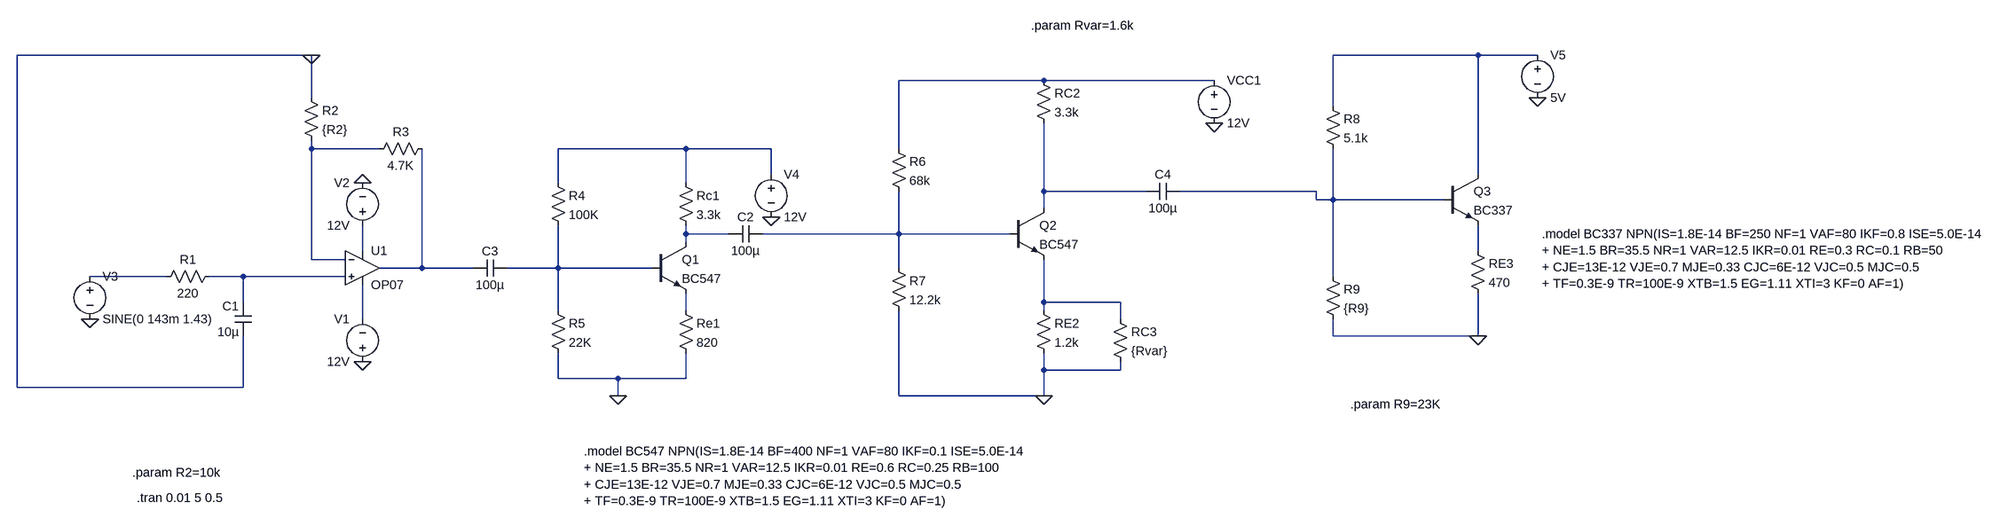
[diagram p0: schematic Project PPG-Based Heartbeat Amplifier.asc]
Project PPG-Based Heartbeat Amplifier.asc, the LTspice schematic file:
Version 4
SHEET 1 1924 680
WIRE -1408 -432 -2016 -432
WIRE 912 -432 640 -432
WIRE 1024 -432 912 -432
WIRE -32 -384 -304 -384
WIRE 288 -384 -32 -384
WIRE -1408 -352 -1408 -432
WIRE 640 -336 640 -432
WIRE -1408 -256 -1408 -272
WIRE -1280 -256 -1408 -256
WIRE -704 -256 -944 -256
WIRE -544 -256 -704 -256
WIRE -304 -256 -304 -384
WIRE -544 -208 -544 -256
WIRE 912 -208 912 -432
WIRE -944 -192 -944 -256
WIRE -704 -192 -704 -256
WIRE -32 -176 -32 -304
WIRE 160 -176 -32 -176
WIRE 608 -176 224 -176
WIRE 608 -160 608 -176
WIRE 640 -160 640 -256
WIRE 640 -160 608 -160
WIRE 848 -160 640 -160
WIRE -32 -144 -32 -176
WIRE -704 -96 -704 -112
WIRE -624 -96 -704 -96
WIRE -304 -96 -304 -176
WIRE -304 -96 -560 -96
WIRE -96 -96 -304 -96
WIRE -704 -80 -704 -96
WIRE -1312 -64 -1312 -112
WIRE 912 -64 912 -112
WIRE -1408 -48 -1408 -256
WIRE -1344 -48 -1408 -48
WIRE -1200 -32 -1200 -256
WIRE -1200 -32 -1280 -32
WIRE -1104 -32 -1200 -32
WIRE -944 -32 -944 -112
WIRE -944 -32 -1040 -32
WIRE -768 -32 -944 -32
WIRE -304 -32 -304 -96
WIRE -1680 -16 -1824 -16
WIRE -1536 -16 -1600 -16
WIRE -1344 -16 -1536 -16
WIRE 640 -16 640 -160
WIRE -1536 32 -1536 -16
WIRE -32 32 -32 -48
WIRE 112 32 -32 32
WIRE -944 48 -944 -32
WIRE -704 48 -704 16
WIRE -32 48 -32 32
WIRE -1312 64 -1312 0
WIRE 112 64 112 32
WIRE 640 96 640 64
WIRE 912 96 912 16
WIRE 912 96 640 96
WIRE -32 160 -32 128
WIRE 112 160 112 144
WIRE 112 160 -32 160
WIRE -944 176 -944 128
WIRE -832 176 -944 176
WIRE -704 176 -704 128
WIRE -704 176 -832 176
WIRE -2016 192 -2016 -432
WIRE -1536 192 -1536 96
WIRE -1536 192 -2016 192
WIRE -832 208 -832 176
WIRE -304 208 -304 48
WIRE -32 208 -32 160
WIRE -32 208 -304 208
FLAG -1408 -432 0
FLAG -1312 -192 0
FLAG -1312 144 0
FLAG -1824 64 0
FLAG -832 208 0
FLAG -544 -128 0
FLAG 288 -304 0
FLAG -32 208 0
FLAG 1024 -352 0
FLAG 912 96 0
SYMBOL Voltage -1312 160 R180
WINDOW 0 24 96 Left 2
WINDOW 3 24 16 Left 2
SYMATTR InstName V1
SYMATTR Value 12V
SYMBOL Voltage -1312 -96 R180
WINDOW 0 24 96 Left 2
WINDOW 3 24 16 Left 2
SYMATTR InstName V2
SYMATTR Value 12V
SYMBOL Voltage -1824 -32 R0
WINDOW 123 0 0 Left 0
WINDOW 39 0 0 Left 0
SYMATTR InstName V3
SYMATTR Value SINE(0 143m 1.43)
SYMBOL Res -1696 0 R270
WINDOW 0 32 56 VTop 2
WINDOW 3 0 56 VBottom 2
SYMATTR InstName R1
SYMATTR Value 220
SYMBOL Res -1424 -368 R0
SYMATTR InstName R2
SYMATTR Value {R2}
SYMBOL Res -1296 -240 R270
WINDOW 0 32 56 VTop 2
WINDOW 3 0 56 VBottom 2
SYMATTR InstName R3
SYMATTR Value 4.7K
SYMBOL Cap -1520 96 R180
WINDOW 0 24 56 Left 2
WINDOW 3 24 8 Left 2
SYMATTR InstName C1
SYMATTR Value 10µ
SYMBOL npn -768 -80 R0
SYMATTR InstName Q1
SYMATTR Value BC547
SYMBOL Res -720 32 R0
SYMATTR InstName Re1
SYMATTR Value 820
SYMBOL Res -720 -208 R0
SYMATTR InstName Rc1
SYMATTR Value 3.3k
SYMBOL Res -960 -208 R0
SYMATTR InstName R4
SYMATTR Value 100K
SYMBOL Res -960 32 R0
SYMATTR InstName R5
SYMATTR Value 22K
SYMBOL Voltage -544 -224 R0
SYMATTR InstName V4
SYMATTR Value 12V
SYMBOL Cap -624 -80 R270
WINDOW 0 32 32 VTop 2
WINDOW 3 0 32 VBottom 2
SYMATTR InstName C2
SYMATTR Value 100µ
SYMBOL Cap -1104 -16 R270
WINDOW 0 32 32 VTop 2
WINDOW 3 0 32 VBottom 2
SYMATTR InstName C3
SYMATTR Value 100µ
SYMBOL npn -96 -144 R0
SYMATTR InstName Q2
SYMATTR Value BC547
SYMBOL Res -320 -272 R0
SYMATTR InstName R6
SYMATTR Value 68k
SYMBOL Res -320 -48 R0
SYMATTR InstName R7
SYMATTR Value 12.2k
SYMBOL Res -48 -400 R0
SYMATTR InstName RC2
SYMATTR Value 3.3k
SYMBOL Res 96 48 R0
SYMATTR InstName RC3
SYMATTR Value {Rvar}
SYMBOL Res -48 32 R0
SYMATTR InstName RE2
SYMATTR Value 1.2k
SYMBOL Voltage 288 -400 R0
SYMATTR InstName VCC1
SYMATTR Value 12V
SYMBOL Cap 160 -160 R270
WINDOW 0 32 32 VTop 2
WINDOW 3 0 32 VBottom 2
SYMATTR InstName C4
SYMATTR Value 100µ
SYMBOL npn 848 -208 R0
SYMATTR InstName Q3
SYMATTR Value BC337
SYMBOL Res 896 -80 R0
SYMATTR InstName RE3
SYMATTR Value 470
SYMBOL Res 624 -352 R0
SYMATTR InstName R8
SYMATTR Value 5.1k
SYMBOL Res 624 -32 R0
SYMATTR InstName R9
SYMATTR Value {R9}
SYMBOL Voltage 1024 -448 R0
SYMATTR InstName V5
SYMATTR Value 5V
SYMBOL OpAmps\\OP07 -1312 -96 R0
SYMATTR InstName U1
TEXT -1744 352 Left 2 !.param R2=10k
TEXT -1736 400 Left 2 !.tran 0.01 5 0.5
TEXT -896 312 Left 2 !.model BC547 NPN(IS=1.8E-14 BF=400 NF=1 VAF=80 IKF=0.1 ISE=5.0E-14 \n+ NE=1.5 BR=35.5 NR=1 VAR=12.5 IKR=0.01 RE=0.6 RC=0.25 RB=100 \n+ CJE=13E-12 VJE=0.7 MJE=0.33 CJC=6E-12 VJC=0.5 MJC=0.5 \n+ TF=0.3E-9 TR=100E-9 XTB=1.5 EG=1.11 XTI=3 KF=0 AF=1)
TEXT -56 -488 Left 2 !.param Rvar=1.6k
TEXT 672 224 Left 2 !.param R9=23K
TEXT 1032 -96 Left 2 !.model BC337 NPN(IS=1.8E-14 BF=250 NF=1 VAF=80 IKF=0.8 ISE=5.0E-14\n+ NE=1.5 BR=35.5 NR=1 VAR=12.5 IKR=0.01 RE=0.3 RC=0.1 RB=50\n+ CJE=13E-12 VJE=0.7 MJE=0.33 CJC=6E-12 VJC=0.5 MJC=0.5\n+ TF=0.3E-9 TR=100E-9 XTB=1.5 EG=1.11 XTI=3 KF=0 AF=1)

The netlist it stands for:
* Project PPG-Based Heartbeat Amplifier.asc
V1 0 N017 12V
V2 N009 0 12V
V3 N013 0 SINE(0 143m 1.43)
R1 N013 N014 220
R2 0 N003 {R2}
R3 N003 N011 4.7K
C1 0 N014 10µ
Q1 N007 N012 N016 0 BC547
Re1 N016 0 820
Rc1 N004 N007 3.3k
R4 N004 N012 100K
R5 N012 0 22K
V4 N004 0 12V
C2 N007 N008 100µ
C3 N011 N012 100µ
Q2 N005 N008 N015 0 BC547
R6 N002 N008 68k
R7 N008 0 12.2k
RC2 N002 N005 3.3k
RC3 N015 0 {Rvar}
RE2 N015 0 1.2k
VCC1 N002 0 12V
C4 N005 N006 100µ
Q3 N001 N006 N010 0 BC337
RE3 N010 0 470
R8 N001 N006 5.1k
R9 N006 0 {R9}
V5 N001 0 5V
XU1 N014 N003 N009 N017 N011 LT1001  ; OP07, pins In+ In- V+ V- OUT
.model NPN NPN
.model PNP PNP
.lib standard.bjt
.param R2=10k
.tran 0.01 5 0.5
.model BC547 NPN(IS=1.8E-14 BF=400 NF=1 VAF=80 IKF=0.1 ISE=5.0E-14
+ NE=1.5 BR=35.5 NR=1 VAR=12.5 IKR=0.01 RE=0.6 RC=0.25 RB=100
+ CJE=13E-12 VJE=0.7 MJE=0.33 CJC=6E-12 VJC=0.5 MJC=0.5
+ TF=0.3E-9 TR=100E-9 XTB=1.5 EG=1.11 XTI=3 KF=0 AF=1)
.param Rvar=1.6k
.param R9=23K
.model BC337 NPN(IS=1.8E-14 BF=250 NF=1 VAF=80 IKF=0.8 ISE=5.0E-14
+ NE=1.5 BR=35.5 NR=1 VAR=12.5 IKR=0.01 RE=0.3 RC=0.1 RB=50
+ CJE=13E-12 VJE=0.7 MJE=0.33 CJC=6E-12 VJC=0.5 MJC=0.5
+ TF=0.3E-9 TR=100E-9 XTB=1.5 EG=1.11 XTI=3 KF=0 AF=1)
.lib LTC.lib
.backanno
.end